# EAGLE design ardBeeQueen (EAGLE 9.3.1)
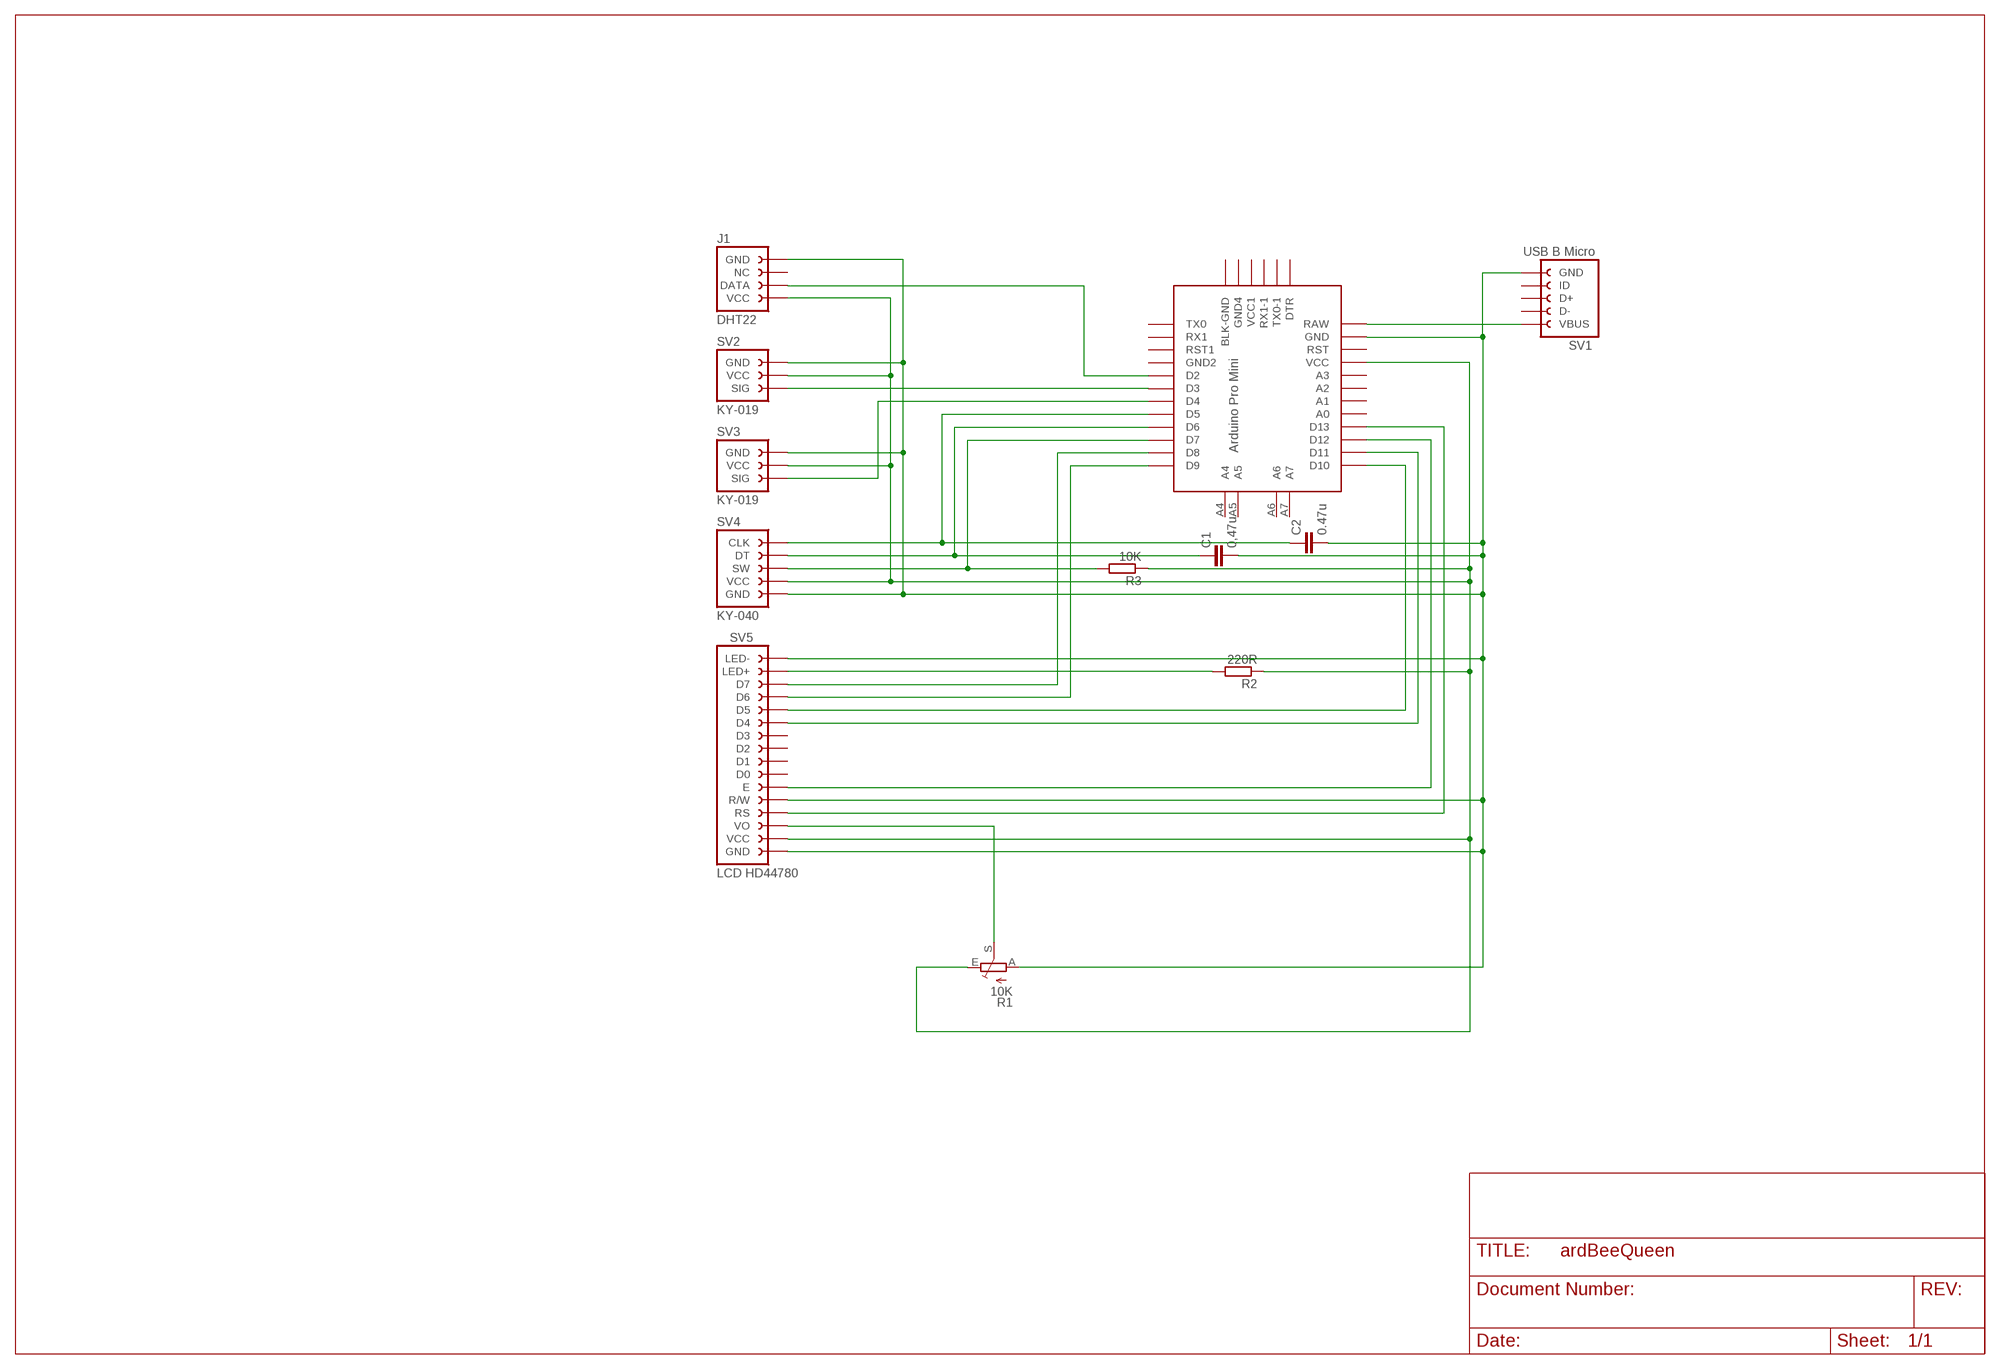
[diagram p0: schematic, sheet 1]

## Parts
C1  0,47u  C-EU050-024X044  [C050-024X044]
C2  0.47u  C-EU050-024X044  [C050-024X044]
J1  DHT22_4-PIN_FEMALE_HEADERPTH  [DHT22_4-PIN_FEMALE_HEADER]
R1  10K  TRIM_EU-B25P  [B25P]
R2  220R  R-EU_0207/10  [0207/10]
R3  10K  R-EU_0207/10  [0207/10]
SV1  MICROUSB_B_BREAKOUT_5-PIN_FEMALE_HEADERWITH_MOUNT_HOLES  [MICROUSB_B_BREAKOUT_5-PIN_FEMALE_HEADER_W_MOUNT_HOLES]
SV2  KY-019_3-PIN_FEMALE_HEADER  [KY-019_3-PIN_FEMALE_HEADER]
SV3  KY-019_3-PIN_FEMALE_HEADER  [KY-019_3-PIN_FEMALE_HEADER]
SV4  KY-040_5-PIN_FEMALE_HEADER  [KY-040_5-PIN_FEMALE_HEADER]
SV5  LCD-HD44780-16-PIN_FEMALE_HEADER  [LCD-HD44780-16-PIN_FEMALE_HEADER]
U$1  ARDUINO_PRO_MINI-2  [ARDUINO_PRO_MINI-2]

## Nets
N$1: R1.S SV5.VO
N$2: R2.2 SV5.LED+
N$3: SV5.D6 U$1.D9
N$4: SV5.D7 U$1.D8
N$5: SV5.D5 U$1.D10
N$6: SV5.D4 U$1.D11
N$7: SV5.E U$1.D12
N$8: SV5.RS U$1.D13
N$9: R3.2 SV4.SW U$1.D7
N$10: C1.1 SV4.DT U$1.D6
N$11: C2.1 SV4.CLK U$1.D5
N$12: J1.DATA U$1.D2
N$13: SV2.SIG U$1.D3
N$14: SV3.SIG U$1.D4
N$15: J1.VCC R1.E R2.1 R3.1 SV2.VCC SV3.VCC SV4.VCC SV5.VCC U$1.VCC
N$16: C1.2 C2.2 J1.GND R1.A SV1.GND SV2.GND SV3.GND SV4.GND SV5.GND SV5.LED- SV5.R/W U$1.GND
N$17: SV1.VBUS U$1.RAW
Unconnected: J1.NC SV1.D+ SV1.D- SV1.ID SV5.D0 SV5.D1 SV5.D2 SV5.D3 U$1.A0 U$1.A1 U$1.A2 U$1.A3 U$1.A4 U$1.A5 U$1.A6 U$1.A7 U$1.BLK-GND U$1.DTR U$1.GND1(GND2) U$1.GND3(GND4) U$1.RST U$1.RST1 U$1.RX1 U$1.RX1-1 U$1.TX0 U$1.TX0-1 U$1.VCC1

## Library data of the parts
C1 C2 = rcl:C-EU: CAPACITOR, European symbol; SPICEPREFIX: C
J1 = myLib-01-Headers:DHT22_4-PIN_FEMALE_HEADER: Header for the DHT22 four pin module. Female; PROD_ID: CONN-09696
R1 = pot:TRIM_EU-: POTENTIOMETER
R2 R3 = rcl:R-EU_: RESISTOR, European symbol; SPICEPREFIX: R
SV1 = myLib-01-Headers:MICROUSB_B_BREAKOUT_5-PIN_FEMALE_HEADER: Header for the micro USB five pin breakout Female
SV2 SV3 = myLib-01-Headers:KY-019_3-PIN_FEMALE_HEADER: Header for the 3 pin KY-019 arduino relay module Female https://www.keyestudio.com/free-shipping-keyestudio-single-5v-relay-module-compatible-with-arduino-uno-r3-mega-p0195-p0195.html https://tkkrlab.nl/wiki/Arduino_KY-019_5V_relay_module Board size: 27 x 34 mm Hole distances: 20.05 x 29 mm Lower edge to lower holes and in pins: 3 mm Hole diameter: 3.5 mm Lower left hole to Sig pin: 11 mm - pin to lower right hole: 4.5 mm Pins reaches 5 mm outside board edge; OC_FARNELL: unknown; OC_NEWARK: unknown
SV4 = myLib-01-Headers:KY-040_5-PIN_FEMALE_HEADER: Header for the 5 pin KY-040 arduino rotary encoder module Female https://www.keyestudio.com/free-shipping-keyestudio-rotary-rotation-encoder-module-for-arduino-p0127.html https://tkkrlab.nl/wiki/Arduino_KY-040_Rotary_encoder_module; OC_FARNELL: unknown; OC_NEWARK: unknown
SV5 = myLib-01-Headers:LCD-HD44780-16-PIN_FEMALE_HEADER: Header for the 16 pin HD44780 LCD module Female; OC_FARNELL: unknown; OC_NEWARK: unknown
U$1 = myLib-02-Arduino:ARDUINO_PRO_MINI-2: Arduino Pro Mini Layout 2 Sparkfun.com

## Net classes
0 default: width 0.406 mm, clearance 0.152 mm

## Board
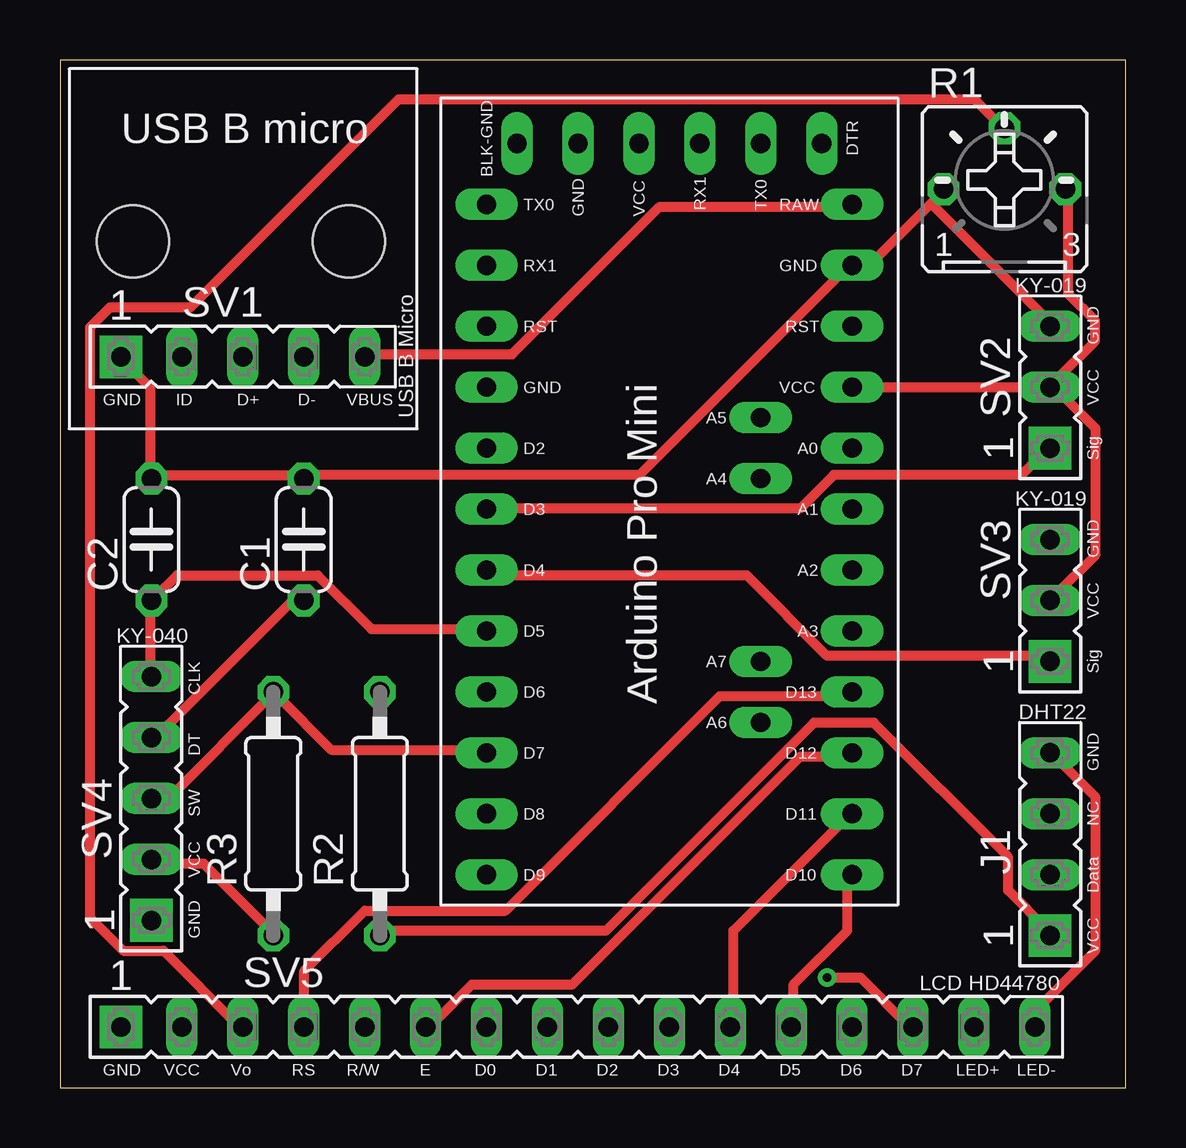
[diagram p1: board, top side]
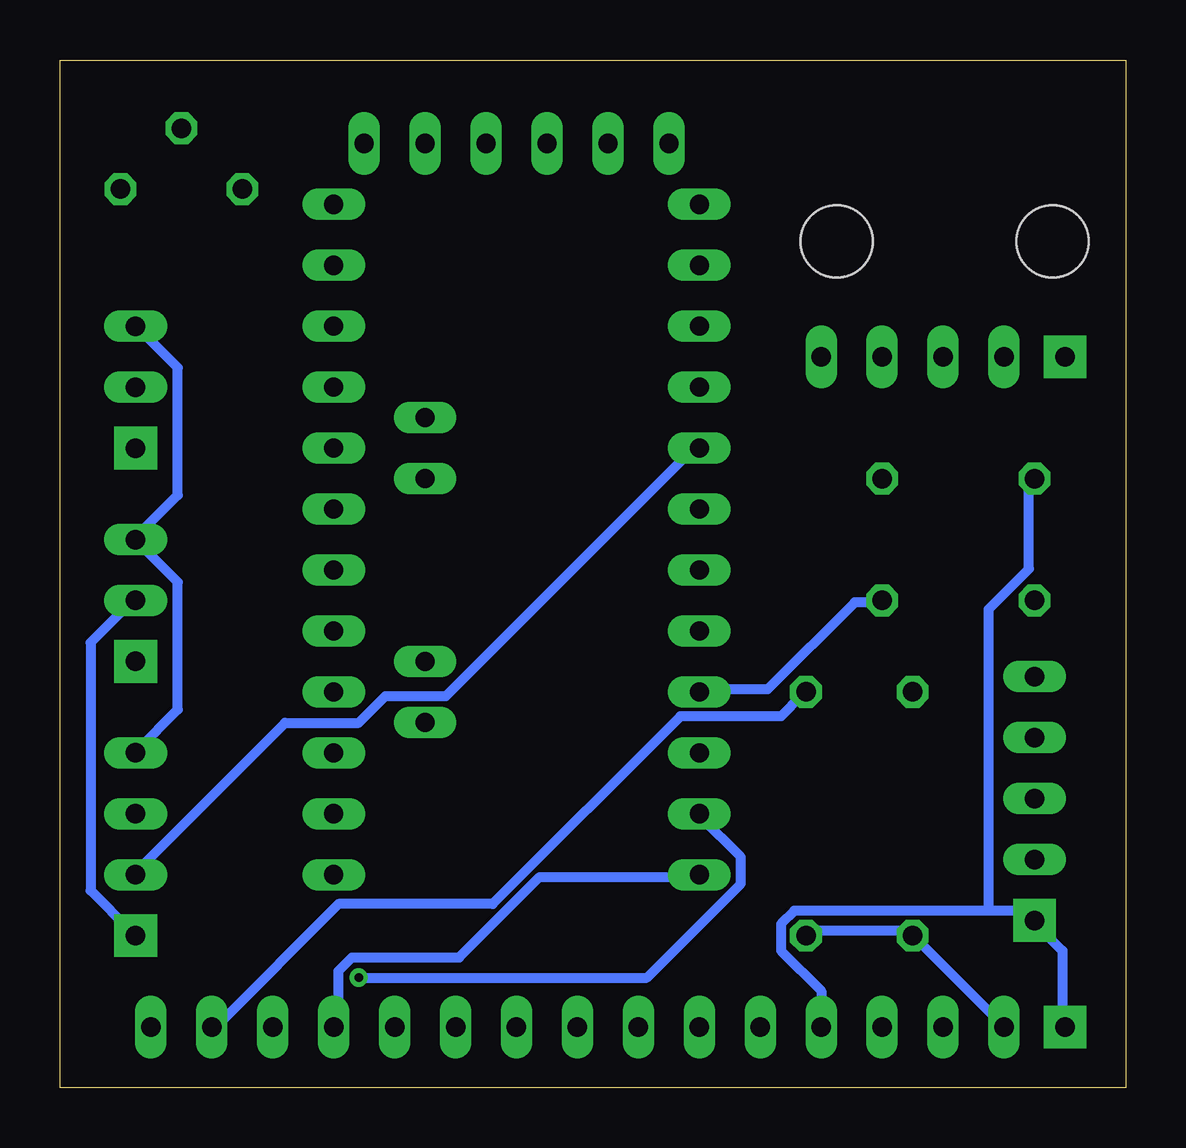
[diagram p2: board, bottom side, seen from below]

Size 44.43 x 42.85 mm. Coordinates in mm from the lower left corner, seen from the top.
Outline: 0,0 44.43,0 44.43,42.85 0,42.85 0,0
Copper layers (1*16): Top 0.035mm / dielectric 1.5mm / Bottom 0.035mm
Design rules "default": minimum track width 6mil, minimum drill 0.35mm, track to track 6mil, track to pad 6mil, pad to pad 6mil, via to via 6mil, smd to smd 6mil, copper to edge 40mil, drill to drill 6mil, minimum pad ring 10mil, minimum via ring 8mil, stop-mask expansion 4mil, vias tented up to drill 0mil, thermal gap 10mil

### Footprints (pad centres in the part's own frame; a part is rotated, then mirrored left to right if it is on the bottom)
C050-024X044 = drill 0.813 octagon: 1 -2.54,0; 2 2.54,0
DHT22_4-PIN_FEMALE_HEADER = drill 0.813 long: DATA 2.54,0; GND 7.62,0; NC 5.08,0 | drill 0.813 pad 1.778 square: VCC 0,0
B25P = drill 0.813 octagon: A -2.54,0; E 2.54,0; S 0,2.54
0207/10 = drill 0.813 octagon: 1 -5.08,0; 2 5.08,0
MICROUSB_B_BREAKOUT_5-PIN_FEMALE_HEADER_W_MOUNT_HOLES = drill 0.813 long: D+ 5.08,0; D- 7.62,0; ID 2.54,0; VBUS 10.16,0 | drill 0.813 pad 1.778 square: GND 0,0 | hole 3: 0.508,4.81; 9.508,4.81
KY-019_3-PIN_FEMALE_HEADER = drill 0.813 long: GND 5.08,0; VCC 2.54,0 | drill 0.813 pad 1.778 square: SIG 0,0
KY-040_5-PIN_FEMALE_HEADER = drill 0.813 long: CLK 10.16,0; DT 7.62,0; SW 5.08,0; VCC 2.54,0 | drill 0.813 pad 1.778 square: GND 0,0
LCD-HD44780-16-PIN_FEMALE_HEADER = drill 0.813 long: D0 15.24,0; D1 17.78,0; D2 20.32,0; D3 22.86,0; D4 25.4,0; D5 27.94,0; D6 30.48,0; D7 33.02,0; E 12.7,0; LED+ 35.56,0; LED- 38.1,0; R/W 10.16,0; RS 7.62,0; VCC 2.54,0; VO 5.08,0 | drill 0.813 pad 1.778 square: GND 0,0
ARDUINO_PRO_MINI-2 = drill 0.8 long: A0 6.35,2.54; A1 6.35,0; A2 6.35,-2.54; A3 6.35,-5.08; A4 2.54,1.27; A5 2.54,3.81; A6 2.54,-8.89; A7 2.54,-6.35; BLK-GND -7.62,15.24; D2 -8.89,2.54; D3 -8.89,0; D4 -8.89,-2.54; D5 -8.89,-5.08; D6 -8.89,-7.62; D7 -8.89,-10.16; D8 -8.89,-12.7; D9 -8.89,-15.24; D10 6.35,-15.24; D11 6.35,-12.7; D12 6.35,-10.16; D13 6.35,-7.62; DTR 5.08,15.24; GND 6.35,10.16; GND1 -8.89,5.08; GND3 -5.08,15.24; RAW 6.35,12.7; RST 6.35,7.62; RST1 -8.89,7.62; RX1 -8.89,10.16; RX1-1 0,15.24; TX0 -8.89,12.7; TX0-1 2.54,15.24; VCC 6.35,5.08; VCC1 -2.54,15.24

### Placement (x,y rotation side)
C1  10.16,22.86 90 top
C2  3.81,22.86 90 top
J1  41.27,6.35 90 top
R1  39.37,37.46 0 top
R2  13.34,11.43 90 top
R3  8.89,11.43 90 top
SV1  2.54,30.48 0 top
SV2  41.27,26.67 90 top
SV3  41.27,17.78 90 top
SV4  3.81,6.99 90 top
SV5  2.54,2.54 0 top
U$1  26.67,24.13 0 top

### Tracks (layer width: path | path; a pad name or v marks a point on that pad's centre or on a via)
N$1
  Top 0.406: SV5.VO 7.39,2.64 4.32,5.72 2.64,5.72 1.25,7.11 1.25,31.7 2.08,32.54 5.44,32.54 14.1,41.2 38.12,41.2 39.24,40.08 R1.S
N$2
  Bottom 0.406: SV5.LED+ 37.85,2.64 32.82,7.67 26.39,7.67 18.57,15.49 14.38,15.49 13.54,16.33 R2.2
N$3
  Bottom 0.406: U$1.D9 18.01,8.79 24.43,8.79 27.79,5.44 32.26,5.44 32.82,4.88 32.82,2.64 SV5.D6
N$4  (via drill 0.35)
  Top 0.406: v31.98,4.6 33.38,4.6 35.33,2.64 SV5.D7
  Bottom 0.406: v31.98,4.6 19.96,4.6 16.05,8.51 16.05,9.63 17.73,11.3 U$1.D8
N$5
  Top 0.406: U$1.D10 32.82,8.79 32.82,6.55 30.58,4.32 30.58,2.64 SV5.D5
N$6
  Top 0.406: U$1.D11 32.82,11.3 28.07,6.55 28.07,2.64 SV5.D4
N$7
  Top 0.406: U$1.D12 32.82,13.82 30.86,13.82 21.36,4.32 17.17,4.32 15.49,2.64 SV5.E
N$8
  Top 0.406: U$1.D13 32.82,16.33 27.51,16.33 18.57,7.39 12.7,7.39 10.19,4.88 10.19,2.64 SV5.RS
N$9
  Top 0.406: U$1.D7 17.73,14.1 11.3,14.1 9.07,16.33 R3.2 8.79,16.33 4.6,12.14 4.04,12.14 SV4.SW
N$10
  Top 0.406: SV4.DT 4.04,14.66 9.91,20.52 C1.1
  Bottom 0.406: U$1.D6 17.73,16.61 14.93,16.61 11.3,20.24 10.19,20.24 C1.1
N$11
  Top 0.406: U$1.D5 17.73,19.13 12.98,19.13 10.74,21.36 4.88,21.36 4.04,20.52 C2.1 3.76,20.24 3.76,17.17 SV4.CLK
N$12
  Bottom 0.406: U$1.D2 18.01,26.67 28.35,16.33 30.86,16.33 31.98,15.21 35.05,15.21 41.2,9.07 J1.DATA
N$13
  Top 0.406: U$1.D3 18.01,24.16 30.86,24.16 32.26,25.55 40.08,25.55 41.2,26.67 SV2.SIG
N$14
  Top 0.406: U$1.D4 18.01,21.36 28.63,21.36 31.98,18.01 41.2,18.01 SV3.SIG
N$15
  Top 0.406: SV4.VCC 4.04,9.35 5.99,9.35 8.79,6.55 R3.1 | U$1.VCC 33.1,29.18 41.2,29.18 SV2.VCC | SV3.VCC 41.48,20.52 43.15,22.2 43.15,27.51 41.48,29.18 SV2.VCC | R1.E 42.04,37.29 42.04,33.1 43.15,31.98 43.15,31.14 41.48,29.46 SV2.VCC | R2.1 13.54,6.55 22.76,6.55 31.42,15.21 33.93,15.21 39.52,9.63 39.52,8.23 41.2,6.55 J1.VCC
  Bottom 0.406: SV5.VCC 5.16,2.64 8.79,6.27 R3.1 9.07,6.55 13.26,6.55 R2.1 | J1.VCC 41.48,6.55 43.15,8.23 43.15,18.57 41.48,20.24 SV3.VCC
N$16
  Top 0.406: SV1.GND 2.64,30.3 3.76,29.18 3.76,25.55 C2.2 4.04,25.55 9.91,25.55 C1.2 10.19,25.55 24.16,25.55 32.82,34.21 U$1.GND 33.1,34.49 33.93,34.49 36.31,36.87 | 36.31,36.87 36.73,37.29 R1.A | SV2.GND 41.2,31.98 36.45,36.73 36.31,36.87 | SV5.LED- 40.64,2.64 40.64,3.2 43.15,5.72 43.15,12.14 41.48,13.82 J1.GND
  Bottom 0.406: 5.71,7.39 4.32,7.39 4.04,7.11 SV4.GND 3.76,6.83 2.64,5.72 2.64,2.64 SV5.GND | 5.71,7.39 13.82,7.39 14.38,6.83 14.38,5.72 12.7,4.04 12.7,2.64 SV5.R/W | 5.71,7.39 5.71,19.96 4.04,21.64 4.04,25.27 C2.2 | J1.GND 41.2,14.1 39.52,15.77 39.52,21.08 41.2,22.76 SV3.GND 41.2,23.04 39.52,24.71 39.52,30.02 41.2,31.7 SV2.GND
N$17
  Top 0.406: U$1.RAW 32.82,36.73 24.99,36.73 18.85,30.58 12.7,30.58 SV1.VBUS